# EAGLE design PowerConverter (EAGLE 9.6.2)
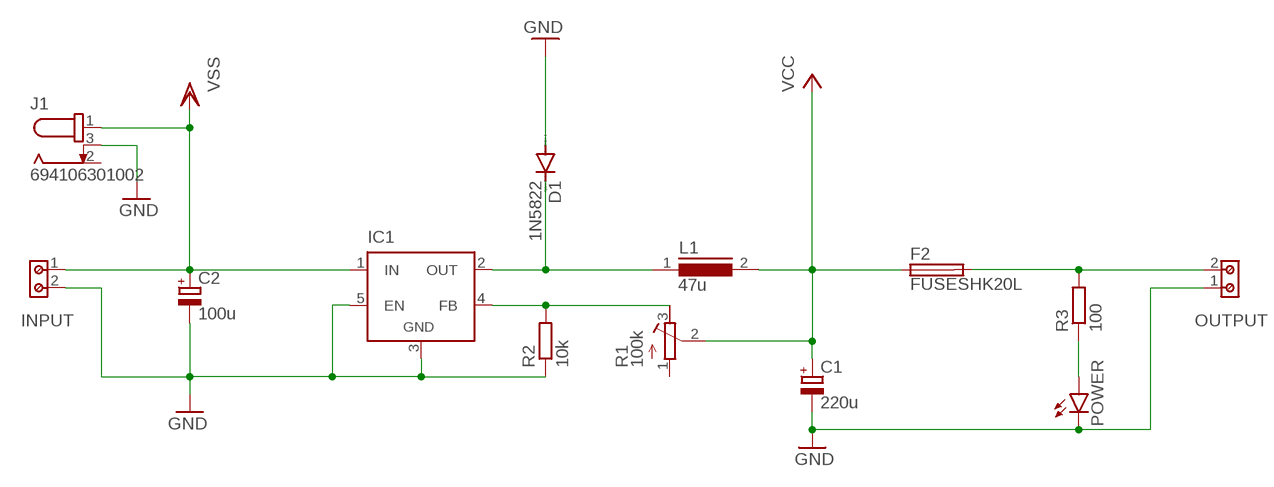
[diagram p0: schematic, sheet 1]

## Parts
C1  220u  CPOL-EUE3.5-8  [E3,5-8]
C2  100u  CPOL-EUE3.5-8  [E3,5-8]
D1  1N5822  1N5624  [DO201-15]
F2  FUSESHK20L  [SHK20L]
IC1  LM2596TV  [TO220-51]
INPUT  691213510002  [691213510002]
J1  694106301002  [694106301002]
L1  47u  A26GFC  [A26GFC]
OUTPUT  691213510002  [691213510002]
POWER  LED5MM  [LED5MM]
R1  100k  R-TRIMM3296W  [RTRIM3296W]
R2  10k  R-EU_0204/7  [0204/7]
R3  100  R-EU_0204/7  [0204/7]

## Nets
GND: C1.- C2.- D1.A IC1.3(GND) IC1.5(EN) INPUT.2 J1.2 J1.3 OUTPUT.1 POWER.K(C) R2.1
N$1: POWER.A R3.1
N$2: D1.C IC1.2(OUT) L1.1
N$3: IC1.4(FB) R1.3(E) R2.2
N$5: F2.2A OUTPUT.2 R3.2
VCC: C1.+ F2.1A L1.2 R1.2(S)
VSS: C2.+ IC1.1(IN) INPUT.1 J1.1
Unconnected: R1.1(A)

## Library data of the parts
C1 C2 = rcl:CPOL-EU: POLARIZED CAPACITOR, European symbol; SPICEPREFIX: C
D1 = diode:1N5624: DIODE controlled avalanche rectifier
F2 = fuse:FUSE: Fuse; OC_FARNELL: unknown; OC_NEWARK: unknown
IC1 = linear:LM2596T: STEP-DOWN VOLTAGE REGULATOR
INPUT OUTPUT = Wurth_Connectors_WR-TBL Rising Cage Clamp:691213510002: WR-TBL Serie 2135 - 5.08 mm Horizontal Entry Modular w. Rising Cage Clamp KIND PROPERTIES Pitch 5.08 mm MATERIAL PROPERTIES Insulator Material PA66 Insulator Flammability Rating UL94 V-0 Contact Material Copper Alloy Contact Plating Tin over Nickel Contact Type Stamped Terminal Screw Material Steel Terminal Screw Plating Zinc Wire Guard Material Copper Alloy GENERAL INFORMATION Operating Temperature -30 up to +120 °C Compliance ROHS & Reach ELECTRICAL PROPERTIES IR UL 14 A IR VDE 14 A Working Voltage [UL] 300 V (AC) Working Voltage [VDE] 250 V (AC) Withstanding Voltage [UL] 1600 V (AC) Withstanding Voltage [VDE] 2000 V (AC) Contact Resistance 20 mΩ MECHANICAL PROPERTIES Wire Strip Length 6 Screw M3 CERTIFICATION UL Approval E150931 VDE Approval 40021366 PACKAGING PROPERTIES Packaging Box <https://www.we-online.com/catalog/media/o32805v209%20Family_WR-TBL2_Series2135.jpg> Details see: https://www.we-online.com/catalog/en/TBL_5_08_2135_HORIZONTAL_ENTRY_MODULAR_69121351000x/ Updated by Ella Wu 2019-11-26 2019(C) Wurth Elektronik; IR-UL: 14A; IR-VDE: 14A; PART-NUMBER: 691213510002; PINS: 2; PITCH: 5.08mm; TYPE: Horizontal; WIRE: 14 to 30 (AWG) 2.08 to 0.0509 (mm²); WORKING-VOLTAGE-UL: 300V (AC); WORKING-VOLTAGE-VDE: 250V (AC)
J1 = DC Power Jacks:694106301002: CONN PWR JACK 2.1X5.5MM SOLDER Manufacturer's datasheet <https://katalog.we-online.de/em/datasheet/6941xx301002.pdf>; CREATED_BY: PCBLayout.com; DIGIKEY_PART_NUMBER: 732-5930-ND; MANUFACTURER: Wurth Electronics Inc.; MPN: 694106301002
L1 = inductors:A26GFC: INDUCTOR; SPICEPREFIX: L
POWER = led:LED: LED OSRAM: - CHIPLED LG R971, LG N971, LY N971, LG Q971, LY Q971, LO R971, LY R971 LH N974, LH R974 LS Q976, LO Q976, LY Q976 LO Q996 - Hyper CHIPLED LW Q18S LB Q993, LB Q99A, LB R99A - SideLED LS A670, LO A670, LY A670, LG A670, LP A670 LB A673, LV A673, LT A673, LW A673 LH A674 LY A675 LS A676, LA A676, LO A676, LY A676, LW A676 LS A679, LY A679, LG A679 - Hyper Micro SIDELED® LS Y876, LA Y876, LO Y876, LY Y876 LT Y87S - SmartLED LW L88C, LW L88S LB L89C, LB L89S, LG L890 LS L89K, LO L89K, LY L89K LS L896, LA L896, LO L896, LY L896 - TOPLED LS T670, LO T670, LY T670, LG T670, LP T670 LSG T670, LSP T670, LSY T670, LOP T670, LYG T670 LG T671, LOG T671, LSG T671 LB T673, LV T673, LT T673, LW T673 LH T674 LS T676, LA T676, LO T676, LY T676, LB T676, LH T676, LSB T676, LW T676 LB T67C, LV T67C, LT T67C, LS T67K, LO T67K, LY T67K, LW E67C LS E67B, LA E67B, LO E67B, LY E67B, LB E67C, LV E67C, LT E67C LW T67C LS T679, LY T679, LG T679 LS T770, LO T770, LY T770, LG T770, LP T770 LB T773, LV T773, LT T773, LW T773 LH T774 LS E675, LA E675, LY E675, LS T675 LS T776, LA T776, LO T776, LY T776, LB T776 LHGB T686 LT T68C, LB T68C - Hyper Mini TOPLED® LB M676 - Mini TOPLED Santana® LG M470 LS M47K, LO M47K, LY M47K Source: http://www.osram.convergy.de LUXEON: - LUMILED® LXK2-PW12-R00, LXK2-PW12-S00, LXK2-PW14-U00, LXK2-PW14-V00 LXK2-PM12-R00, LXK2-PM12-S00, LXK2-PM14-U00 LXK2-PE12-Q00, LXK2-PE12-R00, LXK2-PE12-S00, LXK2-PE14-T00, LXK2-PE14-U00 LXK2-PB12-K00, LXK2-PB12-L00, LXK2-PB12-M00, LXK2-PB14-N00, LXK2-PB14-P00, LXK2-PB14-Q00 LXK2-PR12-L00, LXK2-PR12-M00, LXK2-PR14-Q00, LXK2-PR14-R00 LXK2-PD12-Q00, LXK2-PD12-R00, LXK2-PD12-S00 LXK2-PH12-R00, LXK2-PH12-S00 LXK2-PL12-P00, LXK2-PL12-Q00, LXK2-PL12-R00 Source: www.luxeon.com KINGBRIGHT: KA-3528ASYC Source: www.kingbright.com
R1 = rcl:R-TRIMM: Trimm resistor; SPICEMODEL: X; SPICEPREFIXL: POT
R2 R3 = rcl:R-EU_: RESISTOR, European symbol; SPICEPREFIX: R

## Board
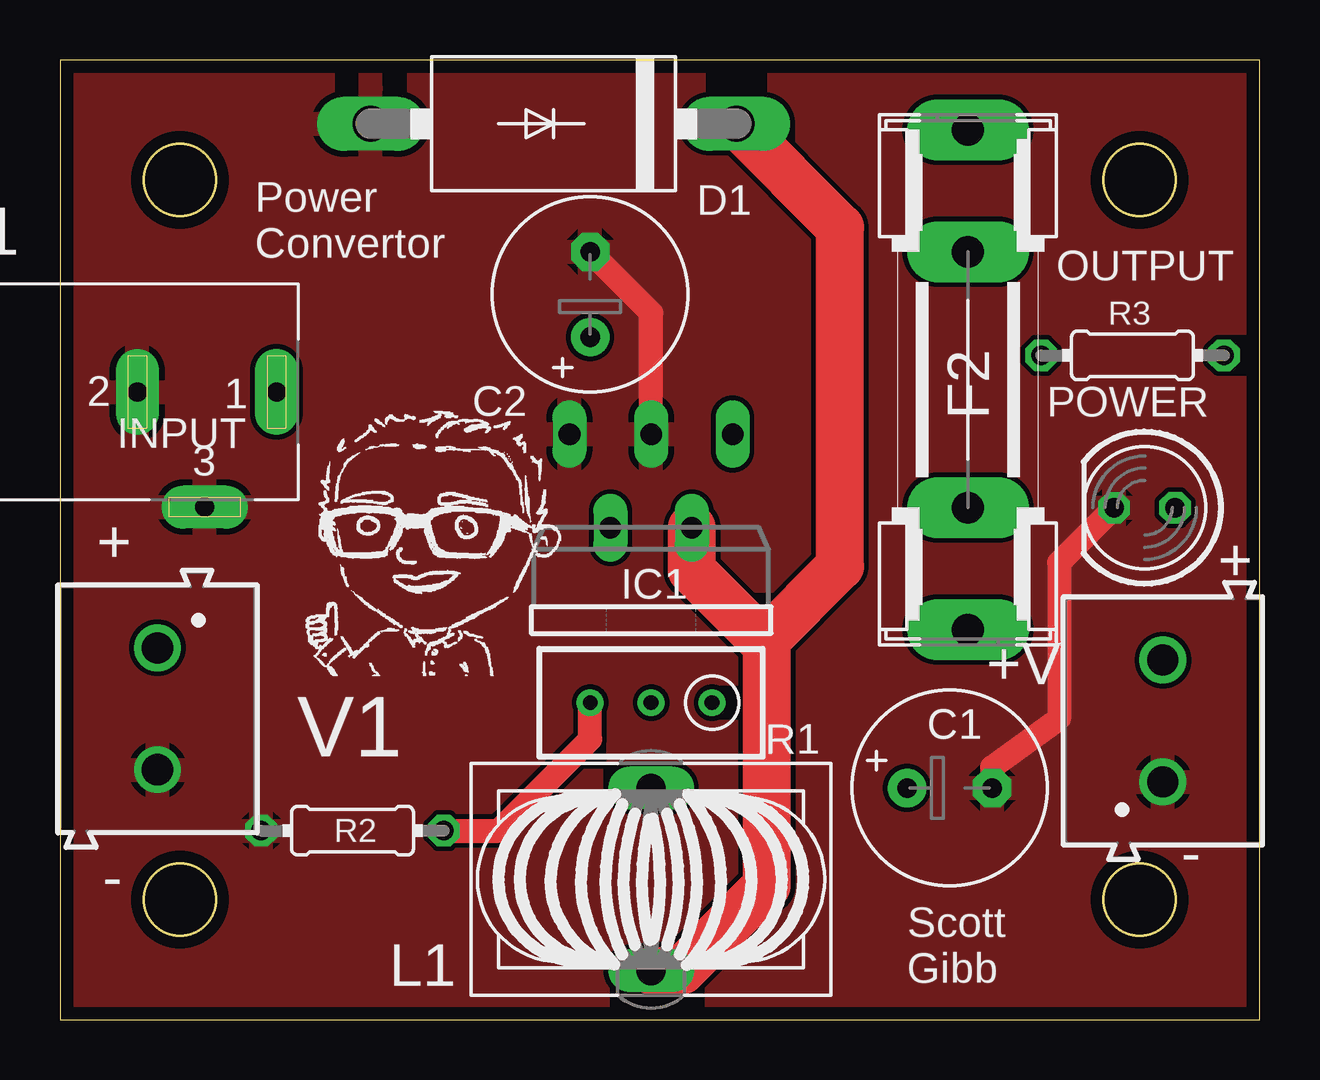
[diagram p1: board, top side]
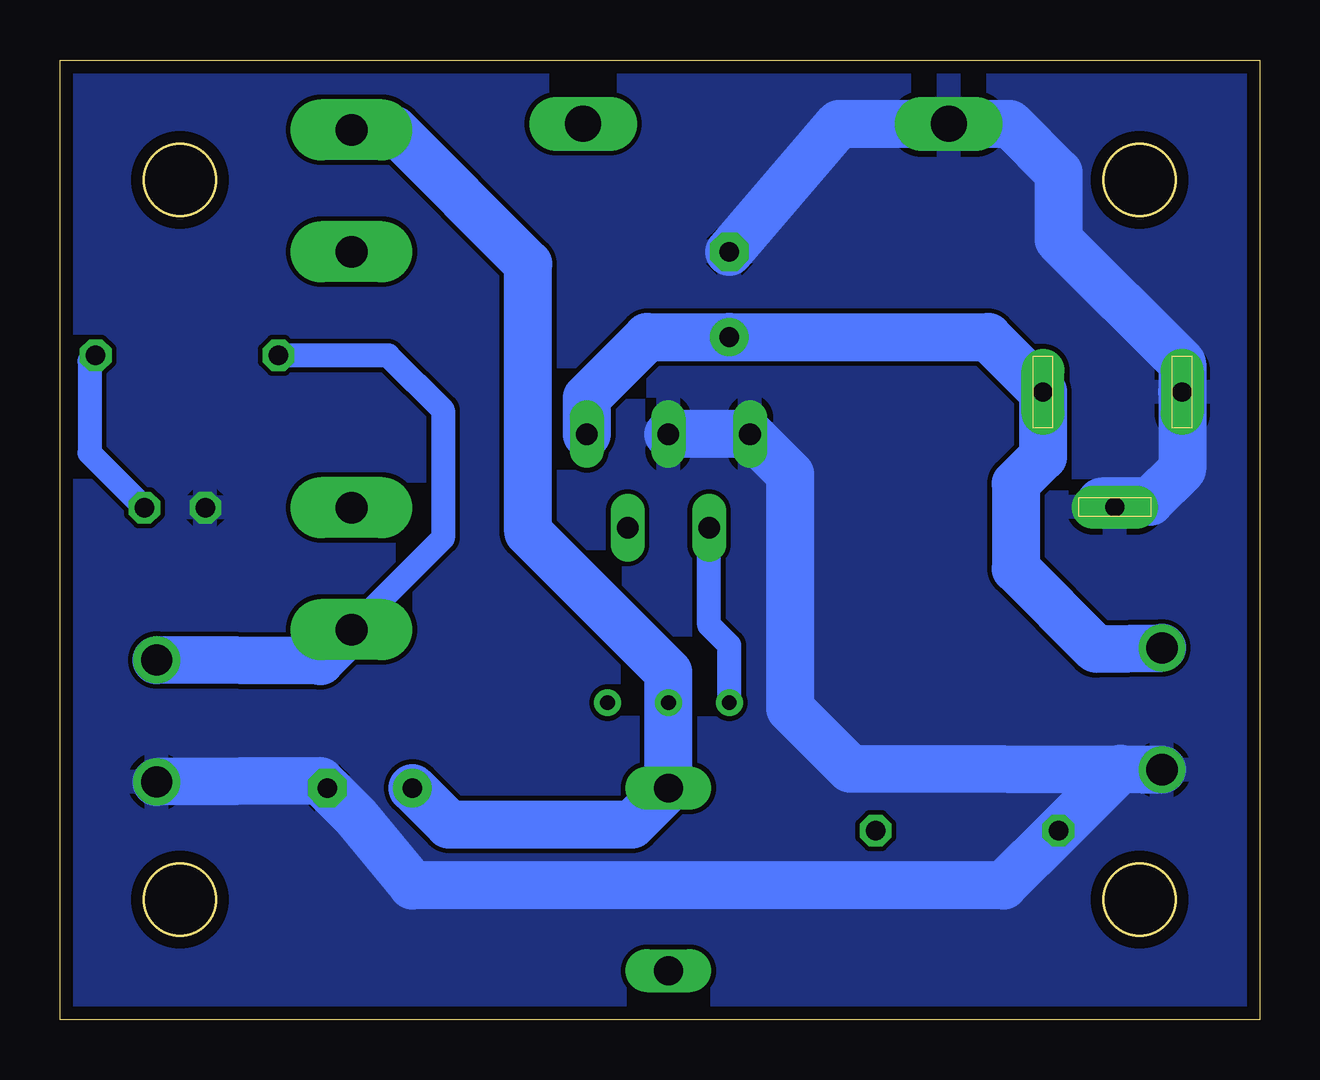
[diagram p2: board, bottom side, seen from below]

Size 50 x 40 mm. Coordinates in mm from the lower left corner, seen from the top.
Outline: 0,40 0,0 50,0 50,40 0,40
Outline: circle at 5,5 radius 1.5
Outline: circle at 5,35 radius 1.5
Outline: circle at 45,5 radius 1.5
Outline: circle at 45,35 radius 1.5
Copper layers (1+2*3+14*15+16): Top 0.035mm / dielectric 1.5mm / Route2 0.035mm / dielectric 0.15mm / Route3 0.035mm / dielectric 0.2mm / Route14 0.035mm / dielectric 0.15mm / Route15 0.035mm / dielectric 0.2mm / Bottom 0.035mm
Design rules "JLCPCB": minimum track width 0.2mm, minimum drill 0.2mm, track to track 0.2mm, track to pad 0.54mm, pad to pad 0.54mm, via to via 0.54mm, smd to smd 0.54mm, copper to edge 0.54mm, drill to drill 0.5mm, minimum pad ring 10mil, minimum via ring 8mil, stop-mask expansion 4mil, vias tented up to drill 0mil, thermal gap 10mil

### Footprints (pad centres in the part's own frame; a part is rotated, then mirrored left to right if it is on the bottom)
E3,5-8 = drill 0.813 pad 1.6: + -1.778,0 | drill 0.813 pad 1.6 octagon: - 1.778,0
DO201-15 = drill 1.499 long: A 7.62,0; C -7.62,0
SHK20L = drill 1.321 pad 2.54 long: 1A -10.414,0; 1B -5.334,0; 2A 10.414,0; 2B 5.334,0
TO220-51 = drill 0.9 long: 1 -3.4,-8.4; 2 -1.7,-4.5; 3 0,-8.4; 4 1.7,-4.5; 5 3.4,-8.4
691213510002 = drill 1.3: 1 -2.54,0; 2 2.54,0
694106301002 = drill 0.8 pad 1.8 long: 1 13.6,0; 2 7.8,0; 3 10.6,-4.8
A26GFC = drill 1.194 long: 1 0,3.81; 2 0,-3.81
LED5MM = drill 0.813 octagon: A -1.27,0; K 1.27,0
RTRIM3296W = drill 0.61: 1 0,-2.54; 2 0,0; 3 0,2.54
0204/7 = drill 0.813 octagon: 1 -3.81,0; 2 3.81,0

### Placement (x,y rotation side)
C1  37.08,9.65 0 top
C2  22.1,30.23 90 top
D1  20.57,37.34 180 top
F2  37.85,26.67 270 top
IC1  24.64,16 180 top
INPUT  4.06,12.95 270 top
J1  -4.57,26.16 0 top
L1  24.64,5.84 180 top
OUTPUT  45.97,12.45 90 top
POWER  45.21,21.34 180 top
R1  24.64,13.21 90 top
R2  12.19,7.87 0 top
R3  44.7,27.69 180 top

### Tracks (layer width: path | path; a pad name or v marks a point on that pad's centre or on a via)
GND
  Top 1: POWER.K 41.66,19.05 41.66,12.56 38.86,10.53 C1.- | IC1.3 24.64,29.46 C2.-
  Bottom 2: IC1.3 IC1.5 19.56,22.72 19.56,12.95 17.06,10.45 INPUT.2 5.8,10.45 R2.1 10.67,5.59 35.31,5.59 37.68,8.47 C1.- 39.16,9.95 OUTPUT.1 | C2.- 17.53,37.34 D1.A 10.41,37.34 8.38,35.31 8.38,32.51 3.23,27.36 J1.2 3.23,22.93 4.57,21.59 6.6,21.59
  pour Bottom: -4.32,49.28 -4.32,-0.25 2.29,-6.86 52.58,-6.86 61.47,2.03 61.47,43.18 55.63,49.02 52.07,52.58 0.25,52.58 -1.02,52.58
  pour Top: -3.56,0.76 0.51,-3.3 54.61,-3.3 55.63,-2.29 55.63,39.37 49.28,45.72 45.97,45.72 -2.03,45.72
N$1
  Bottom 1: R3.1 48.77,27.43 48.77,23.62 POWER.A
N$2
  Top 2: L1.1 25.91,2.03 29.46,5.59 29.46,15.6 | 29.46,15.6 29.46,15.85 32.51,18.9 32.51,33.02 D1.C | 29.46,15.6 26.34,18.72 IC1.2
N$3
  Top 1: R2.2 18.29,7.87 22.1,11.68 R1.3
  Bottom 1: R1.3 22.1,15.6 22.94,16.44 IC1.4
N$5
  Bottom 1: F2.2A 34.04,20.07 34.04,25.4 36.32,27.69 R3.2
  Bottom 2: F2.2A 39.16,14.95 OUTPUT.2
VCC
  Bottom 2: C1.+ 33.78,8.13 26.16,8.13 L1.2 R1.2 24.64,14.48 30.48,20.32 30.48,31.5 36.07,37.08 F2.1A
VSS
  Bottom 2: IC1.1 28.04,25.93 25.52,28.45 C2.+ 11.31,28.45 J1.1 9.03,23.47 10.16,22.34 10.16,18.8 6.82,15.45 INPUT.1

### Text on the board
tNames: Power / Convertor | + | + | +V | V1 | - | - | Scott / Gibb